# EAGLE schematic pic18f46k22_evb (EAGLE 6.4)
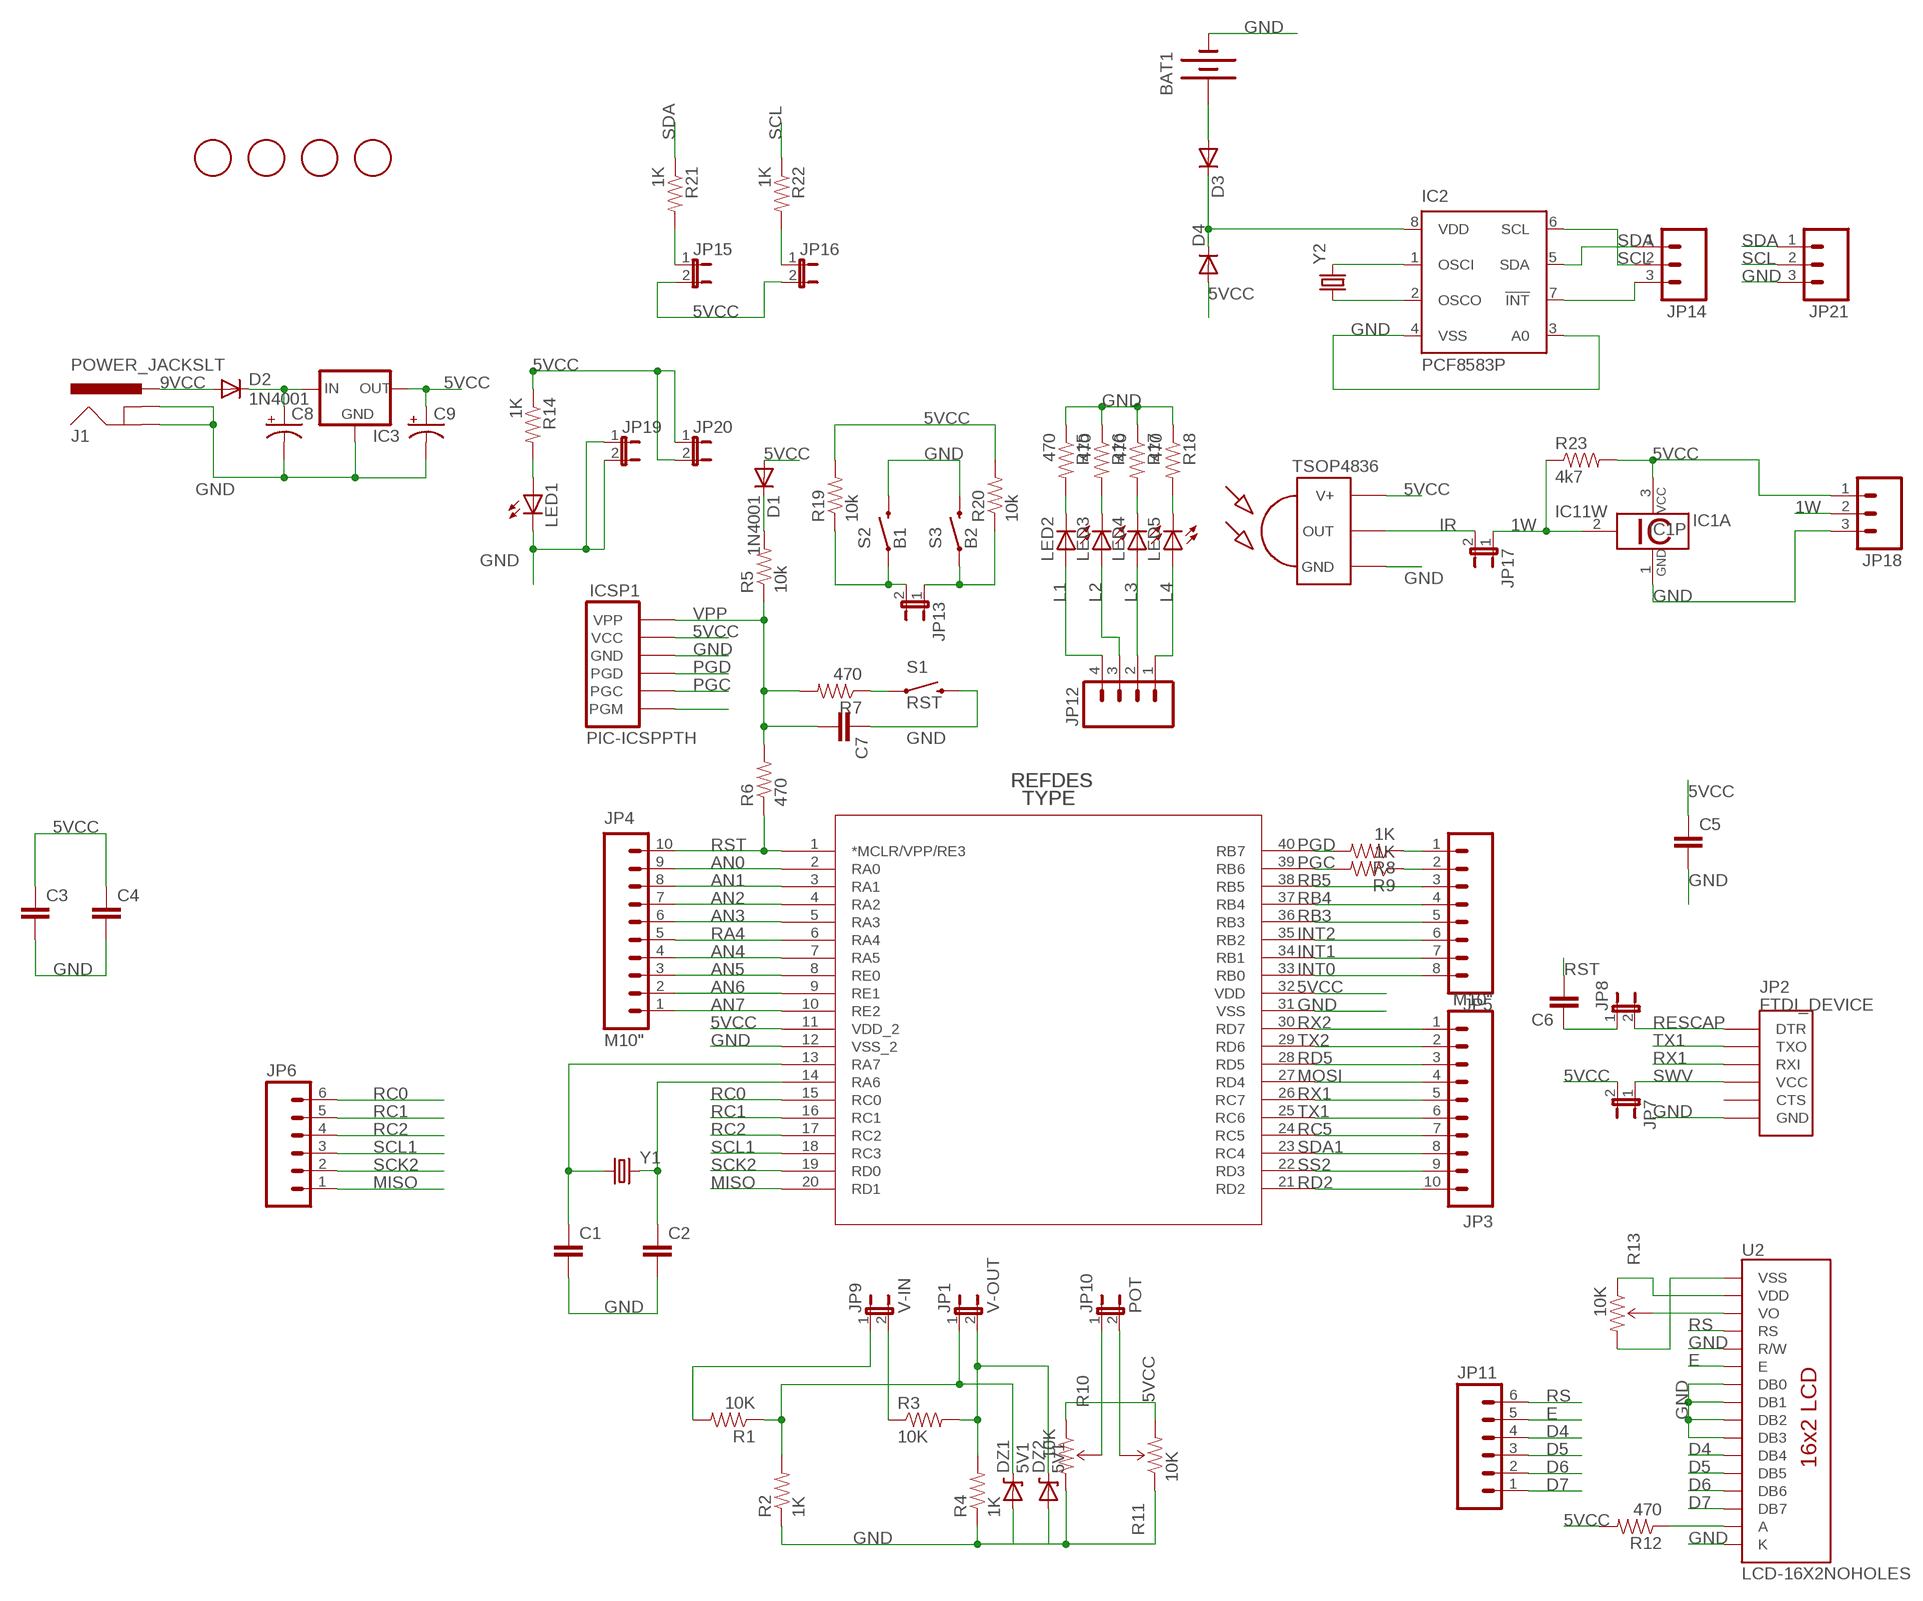
[diagram p0: schematic, sheet 1]

## Parts
BAT1  BATTERY12MM  [BATTCON_12MM]
C1  CAPPTH1  [CAP-PTH-5MM]
C2  CAPPTH1  [CAP-PTH-5MM]
C3  CAPPTH1  [CAP-PTH-5MM]
C4  CAPPTH1  [CAP-PTH-5MM]
C5  CAPPTH1  [CAP-PTH-5MM]
C6  CAPPTH1  [CAP-PTH-5MM]
C7  CAPPTH1  [CAP-PTH-5MM]
C8  CAP_POLPTH1  [CPOL-RADIAL-100UF-25V]
C9  CAP_POLPTH2  [CPOL-RADIAL-10UF-25V]
D1  1N4001  DIODEPTH  [DIODE-1N4001]
D2  1N4001  DIODEPTH  [DIODE-1N4001]
D3  DIODE1N4148  [DIODE-1N4148]
D4  DIODE1N4148  [DIODE-1N4148]
DZ1  5V1  DIODE-ZENERPTH  [DIODE-ZENER]
DZ2  5V1  DIODE-ZENERPTH  [DIODE-ZENER]
IC1  DS18B20  [TO92-]
IC2  PCF8583P  [DIL08]
IC3  V_REG_78XXSINK  [TO220-IGO]
ICSP1  PIC-ICSPPTH  [MOLEX-1X6]
J1  POWER_JACKSLT  [POWER_JACK_SLOT]
JP1  V-OUT  JUMPER-2PTH  [1X02]
JP2  FTDI_DEVICE  [FTDI_DEVICE_SIDE]
JP3  M10"  [1X10]
JP4  M10"  [1X10]
JP5  M081X08  [1X08]
JP6  M06SIP  [1X06]
JP7  JUMPER-2PTH  [1X02]
JP8  JUMPER-2PTH  [1X02]
JP9  V-IN  JUMPER-2PTH  [1X02]
JP10  POT  JUMPER-2PTH  [1X02]
JP11  M06SIP  [1X06]
JP12  M04PTH  [1X04]
JP13  JUMPER-2PTH  [1X02]
JP14  M03PTH  [1X03]
JP15  JUMPER-2PTH  [1X02]
JP16  JUMPER-2PTH  [1X02]
JP17  JUMPER-2PTH  [1X02]
JP18  M03PTH  [1X03]
JP19  JUMPER-2PTH  [1X02]
JP20  JUMPER-2PTH  [1X02]
JP21  M03PTH  [1X03]
LED1  LED3MM  [LED3MM]
LED2  LED3MM  [LED3MM]
LED3  LED3MM  [LED3MM]
LED4  LED3MM  [LED3MM]
LED5  LED3MM  [LED3MM]
R1  10K  RESISTORAXIAL-0.3  [AXIAL-0.3]
R2  1K  RESISTORAXIAL-0.3  [AXIAL-0.3]
R3  10K  RESISTORAXIAL-0.3  [AXIAL-0.3]
R4  1K  RESISTORAXIAL-0.3  [AXIAL-0.3]
R5  10k  RESISTORAXIAL-0.3  [AXIAL-0.3]
R6  470  RESISTORAXIAL-0.3  [AXIAL-0.3]
R7  470  RESISTORAXIAL-0.3  [AXIAL-0.3]
R8  1K  RESISTORAXIAL-0.3  [AXIAL-0.3]
R9  1K  RESISTORAXIAL-0.3  [AXIAL-0.3]
R10  10K  TRIMPOTPTH  [TRIM_POT_PTH]
R11  10K  TRIMPOTPTH  [TRIM_POT_PTH]
R12  470  RESISTORAXIAL-0.3  [AXIAL-0.3]
R13  10K  TRIMPOTPTH  [TRIM_POT_PTH]
R14  1K  RESISTORAXIAL-0.3  [AXIAL-0.3]
R15  470  RESISTORAXIAL-0.3  [AXIAL-0.3]
R16  470  RESISTORAXIAL-0.3  [AXIAL-0.3]
R17  470  RESISTORAXIAL-0.3  [AXIAL-0.3]
R18  470  RESISTORAXIAL-0.3  [AXIAL-0.3]
R19  10k  RESISTORAXIAL-0.3  [AXIAL-0.3]
R20  10k  RESISTORAXIAL-0.3  [AXIAL-0.3]
R21  1K  RESISTORAXIAL-0.3  [AXIAL-0.3]
R22  1K  RESISTORAXIAL-0.3  [AXIAL-0.3]
R23  4k7  RESISTORAXIAL-0.3  [AXIAL-0.3]
S1  RST  SWITCH-MOMENTARY-2PTH  [TACTILE-PTH]
S2  B1  SWITCH-MOMENTARY-2PTH  [TACTILE-PTH]
S3  B2  SWITCH-MOMENTARY-2PTH  [TACTILE-PTH]
U1  PIC18F46K22  MICROCHIP_PIC18F46K22-X_P  [MICROCHIP_PDIP40_600MC]
U2  LCD-16X2NOHOLES  [LCD-16X2_NOHOLES]
U$1  MOUNTINGHOLE3.0THIN  [MOUNTINGHOLE_3.0_PLATEDTHIN]
U$2  MOUNTINGHOLE3.0THIN  [MOUNTINGHOLE_3.0_PLATEDTHIN]
U$3  MOUNTINGHOLE3.0THIN  [MOUNTINGHOLE_3.0_PLATEDTHIN]
U$4  MOUNTINGHOLE3.0THIN  [MOUNTINGHOLE_3.0_PLATEDTHIN]
U$5  TSOP4836  [TSOP18XX]
Y1  CRYSTALHC49UV  [HC49U-V]
Y2  CRYSTALTC38H  [TC38H]

## Nets
1W: IC1.2 JP17.1 JP18.2 R23.P$1
5VCC: C3.1 C4.1 C5.1 C9.1(+) D1.A D4.A IC1.3 IC3.OUT ICSP1.5(VCC) JP7.2 JP15.2 JP16.2 JP18.1 JP20.1 JP20.2 R10.1(CCW) R11.3(CW) R12.P$2 R13.1(CCW) R14.P$1 R19.P$2 R20.P$2 R23.P$2 U1.11(VDD_2) U1.32(VDD) U2.2(VDD) U$5.VCC(V+)
9VCC: D2.A J1.PWR
AN0: JP4.9 U1.2(RA0)
AN1: JP4.8 U1.3(RA1)
AN2: JP4.7 U1.4(RA2)
AN3: JP4.6 U1.5(RA3)
AN4: JP4.4 U1.7(RA5)
AN5: JP4.3 U1.8(RE0)
AN6: JP4.2 U1.9(RE1)
AN7: JP4.1 U1.10(RE2)
D4: JP11.4 U2.11(DB4)
D5: JP11.3 U2.12(DB5)
D6: JP11.2 U2.13(DB6)
D7: JP11.1 U2.14(DB7)
E: JP11.5 U2.6(E)
GND: BAT1.GND(-) C1.2 C2.2 C3.2 C4.2 C5.2 C7.1 C8.2(-) C9.2(-) DZ1.P$2(A) DZ2.P$2(A) IC1.1 IC2.3(A0) IC2.4(VSS) IC3.GND ICSP1.4(GND) J1.GND@1(GNDBREAK) J1.GND@2(GND) JP2.P$6(GND) JP18.3 JP19.1 JP19.2 JP21.3 LED1.K(C) R2.P$1 R4.P$1 R10.3(CW) R11.1(CCW) R13.3(CW) R15.P$1 R16.P$1 R17.P$1 R18.P$1 S1.3 S2.3 S3.3 U1.12(VSS_2) U1.31(VSS) U2.1(VSS) U2.5(R/W) U2.7(DB0) U2.8(DB1) U2.9(DB2) U2.10(DB3) U2.16(K) U$5.GND
INT0: JP5.8 U1.33(RB0)
INT1: JP5.7 U1.34(RB1)
INT2: JP5.6 U1.35(RB2)
IR: JP17.2 U$5.OUT
L1: JP12.4 LED2.A
L2: JP12.3 LED3.A
L3: JP12.2 LED4.A
L4: JP12.1 LED5.A
MISO: JP6.1 U1.20(RD1)
MOSI: JP3.4 U1.27(RD4)
N$1: C1.1 U1.13(RA7) Y1.1
N$2: C2.1 U1.14(RA6) Y1.2
N$3: D1.C R5.P$2
N$4: R7.P$1 S1.1
N$5: JP5.1 R8.P$1
N$6: JP5.2 R9.P$1
N$7: C6.1 JP8.1
N$8: IC2.2(OSCO) Y2.1
N$9: DZ1.P$1(C) JP1.1 R1.P$1 R2.P$2
N$10: DZ2.P$1(C) JP1.2 R3.P$2 R4.P$2
N$11: ICSP1.1(PGM)
N$12: JP9.2 R3.P$1
N$13: JP9.1 R1.P$2
N$14: IC2.1(OSCI) Y2.2
N$15: JP10.1 R10.2(WIPER)
N$16: JP10.2 R11.2(WIPER)
N$17: C8.1(+) D2.C IC3.IN
N$18: R13.2(WIPER) U2.3(VO)
N$19: LED1.A R14.P$2
N$20: LED2.K(C) R15.P$2
N$21: LED3.K(C) R16.P$2
N$22: LED4.K(C) R17.P$2
N$23: LED5.K(C) R18.P$2
N$24: JP13.2 R19.P$1 S2.1
N$25: R12.P$1 U2.15(A)
N$26: JP13.1 R20.P$1 S3.1
N$27: BAT1.PWR@1(+) D3.A
N$28: JP15.1 R21.P$2
N$29: D3.C D4.C IC2.8(VDD)
N$30: IC2.7(!INT) JP14.3
N$31: JP16.1 R22.P$2
PGC: ICSP1.2(PGC) R9.P$2 U1.39(RB6)
PGD: ICSP1.3(PGD) R8.P$2 U1.40(RB7)
RA4: JP4.5 U1.6(RA4)
RB3: JP5.5 U1.36(RB3)
RB4: JP5.4 U1.37(RB4)
RB5: JP5.3 U1.38(RB5)
RC0: JP6.6 U1.15(RC0)
RC1: JP6.5 U1.16(RC1)
RC2: JP6.4 U1.17(RC2)
RC5: JP3.7 U1.24(RC5)
RD2: JP3.10 U1.21(RD2)
RD5: JP3.3 U1.28(RD5)
RESCAP: JP2.P$1(DTR) JP8.2
RS: JP11.6 U2.4(RS)
RST: C6.2 JP4.10 R6.P$1 U1.1(*MCLR/VPP/RE3)
RX1: JP2.P$3(RXI) JP3.5 U1.26(RC7)
RX2: JP3.1 U1.30(RD7)
SCK2: JP6.2 U1.19(RD0)
SCL: IC2.6(SCL) JP14.2 JP21.2 R22.P$1
SCL1: JP6.3 U1.18(RC3)
SDA: IC2.5(SDA) JP14.1 JP21.1 R21.P$1
SDA1: JP3.8 U1.23(RC4)
SS2: JP3.9 U1.22(RD3)
SWV: JP2.P$4(VCC) JP7.1
TX1: JP2.P$2(TXO) JP3.6 U1.25(RC6)
TX2: JP3.2 U1.29(RD6)
VPP: C7.2 ICSP1.6(VPP) R5.P$1 R6.P$2 R7.P$2
Unconnected: JP2.P$5(CTS)

## Library data of the parts
BAT1 = SparkFun-Electromechanical:BATTERY: Battery Holders Various common sizes : AA, AAA, 20mm coin cell and 12mm coin cell. 20MM_4LEGS, BATT-10373
C1-C7 = SparkFun-Passives:CAP: Capacitor Standard 0603 ceramic capacitor, and 0.1" leaded capacitor.
C8 C9 = SparkFun-Capacitors:CAP_POL: Capacitor Polarized These are standard SMD and PTH capacitors. Normally 10uF, 47uF, and 100uF in electrolytic and tantalum varieties. Always verify the external diameter of the through hole cap, it varies with capacity, voltage, and manufacturer. The EIA devices should be standard.
D1-D4 = SparkFun-DiscreteSemi:DIODE: Diode These are standard reverse protection diodes and small signal diodes. SMA package can handle up to about 1A. SOD-323 can handle about 200mA. What the SOD-323 package when ordering, there are some mfgs out there that are 5-pin packages.
DZ1 DZ2 = SparkFun-DiscreteSemi:DIODE-ZENER: Zener Diode Production Part - 8199 3.4V Zener Voltage
IC1 = 1wire:DS18B20: Programmable Resolution Digital Thermometer This chip provides a onewire thermosensor with approx. 0.5°C accuracy. A programmable over/undertemperure alarm is available. The precision can be set from 9..12 bits. Notes: Vdd must be applied for accurate measurements at low temperatures, as the parasite power circuit otherwise heats the sensor. If parasite power is used, Vdd has to be connected to GND. The DS1822 is a low-cost thermometer chip, the DS18S20 is similar to the DS18B20, but with 9 Bit precision only. Author: Jan Kandziora <jjj@gmx.de>
IC2 = ds1307_pcf8583:PCF8583: I2C-Bus CLOCK/CALENDAR
IC3 = SparkFun-PowerIC:V_REG_78XX: Voltage Regulator Standard 7805 5V regulator. IGO (Input Ground Output). Spark Fun Electronics SKU : COM-00107
ICSP1 = SparkFun-Connectors:PIC-ICSP: ISCP Programming connector for UAV, UBW Kit, etc.
J1 = SparkFun-Connectors:POWER_JACK: Power Jack This is the standard 5.5mm barrel jack for power. The PTH is the most common, proven, reliable, footprint. The Slot footprint only works if the mill layer is transmitted to the PCB fab house so be warned. Spark Fun Electronics SKU : PRT-00119 SMT: CONN-08106 Mating wall wart : TOL-00298 (and others)
JP1 JP7-JP10 JP13 JP15-JP17 JP19 JP20 = SparkFun-Passives:JUMPER-2: Jumper Basic 0.1" spaced jumper. Use with breakaway headers.
JP2 = SparkFun-Connectors:FTDI_DEVICE: Connector which mates to FTDI basic or FTDI cable.
JP3 JP4 = SparkFun-Connectors:M10: Header 10 Standard 10-pin 0.1" header. Use with straight break away headers (SKU : PRT-00116), right angle break away headers (PRT-00553), swiss pins (PRT-00743), machine pins (PRT-00117), and female headers (PRT-00115).
JP5 = SparkFun-Connectors:M08: Header 8 Standard 8-pin 0.1" header. Use with straight break away headers (SKU : PRT-00116), right angle break away headers (PRT-00553), swiss pins (PRT-00743), machine pins (PRT-00117), and female headers (PRT-00115).
JP6 JP11 = SparkFun-Connectors:M06: Header 6 Standard 6-pin 0.1" header. Use with straight break away headers (SKU : PRT-00116), right angle break away headers (PRT-00553), swiss pins (PRT-00743), machine pins (PRT-00117), and female headers (PRT-00115). Molex polarized connector foot print use with SKU : PRT-08094 with associated crimp pins and housings. NOTES ON THE VARIANTS LOCK and LOCK_LONGPADS... This footprint was designed to help hold the alignment of a through-hole component (i.e. 6-pin header) while soldering it into place. You may notice that each hole has been shifted either up or down by 0.005 of an inch from it's more standard position (which is a perfectly straight line). This slight alteration caused the pins (the squares in the middle) to touch the edges of the holes. Because they are alternating, it causes a "brace" to hold the component in place. 0.005 has proven to be the perfect amount of "off-center" position when using our standard breakaway headers. Although looks a little odd when you look at the bare footprint, once you have a header in there, the alteration is very hard to notice. Also, if you push a header all the way into place, it is covered up entirely on the bottom side. This idea of altering the position of holes to aid alignment will be further integrated into the Sparkfun Library for other footprints. It can help hold any component with 3 or more connection pins.
JP12 = SparkFun-Connectors:M04: Header 4 Standard 4-pin 0.1" header. Use with straight break away headers (SKU : PRT-00116), right angle break away headers (PRT-00553), swiss pins (PRT-00743), machine pins (PRT-00117), and female headers (PRT-00115). Molex polarized connector foot print use with SKU : PRT-08231 with associated crimp pins and housings. 1MM SMD Version SKU: PRT-10208
JP14 JP18 JP21 = SparkFun-Connectors:M03: Header 3 Standard 3-pin 0.1" header. Use with straight break away headers (SKU : PRT-00116), right angle break away headers (PRT-00553), swiss pins (PRT-00743), machine pins (PRT-00117), and female headers (PRT-00115). Molex polarized connector foot print use with SKU : PRT-08232 with associated crimp pins and housings.
LED1-LED5 = SparkFun-LED:LED: LEDs Standard schematic elements and footprints for 5mm, 3mm, 1206, and 0603 sized LEDs. 5mm - Spark Fun Electronics SKU : COM-00529 (and others)
R1 R3 R4 R6-R9 R12 R14-R18 R21-R23 = SparkFun-Passives:RESISTOR: Resistor Basic schematic elements and footprints for 0603, 1206, and PTH resistors.
R2 R5 R19 R20 = SparkFun-Resistors:RESISTOR: Resistor Basic schematic elements and footprints for 0603, 1206, and PTH resistors.
R10 R11 R13 = SparkFun-Electromechanical:TRIMPOT: Various small potentiometers for "set-and-forget" applications
S1-S3 = SparkFun-Electromechanical:SWITCH-MOMENTARY-2: Various NO switches- pushbuttons, reed, etc
U1 = pic18f46k22_evb:MICROCHIP_PIC18F46K22-X_P
U2 = SparkFun-Displays:LCD-16X2: Standard text-only 16x2 parallel input LCD
U$1-U$4 = microbuilder:MOUNTINGHOLE: Mounting Hole
U$5 = tsop-1:TSOP4836: IR Receiver and Demodulator
Y1 Y2 = SparkFun-FreqCtrl:CRYSTAL: Various standard crystals. Proven footprints. Spark Fun Electronics SKU : COM-00534